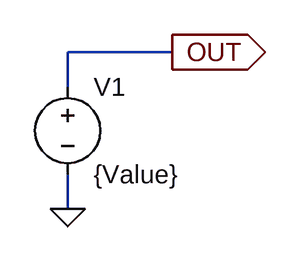
[diagram p0: schematic Value.asc]
Value.asc, the LTspice schematic file:
Version 4
SHEET 1 880 680
WIRE 304 112 208 112
WIRE 208 144 208 112
WIRE 208 256 208 224
FLAG 208 256 0
FLAG 304 112 OUT
IOPIN 304 112 Out
SYMBOL voltage 208 128 R0
SYMATTR InstName V1
SYMATTR Value {Value}

The netlist it stands for:
* Value.asc
V1 OUT 0 {Value}
.backanno
.end